# EAGLE schematic DUObot (EAGLE 7.3.0)
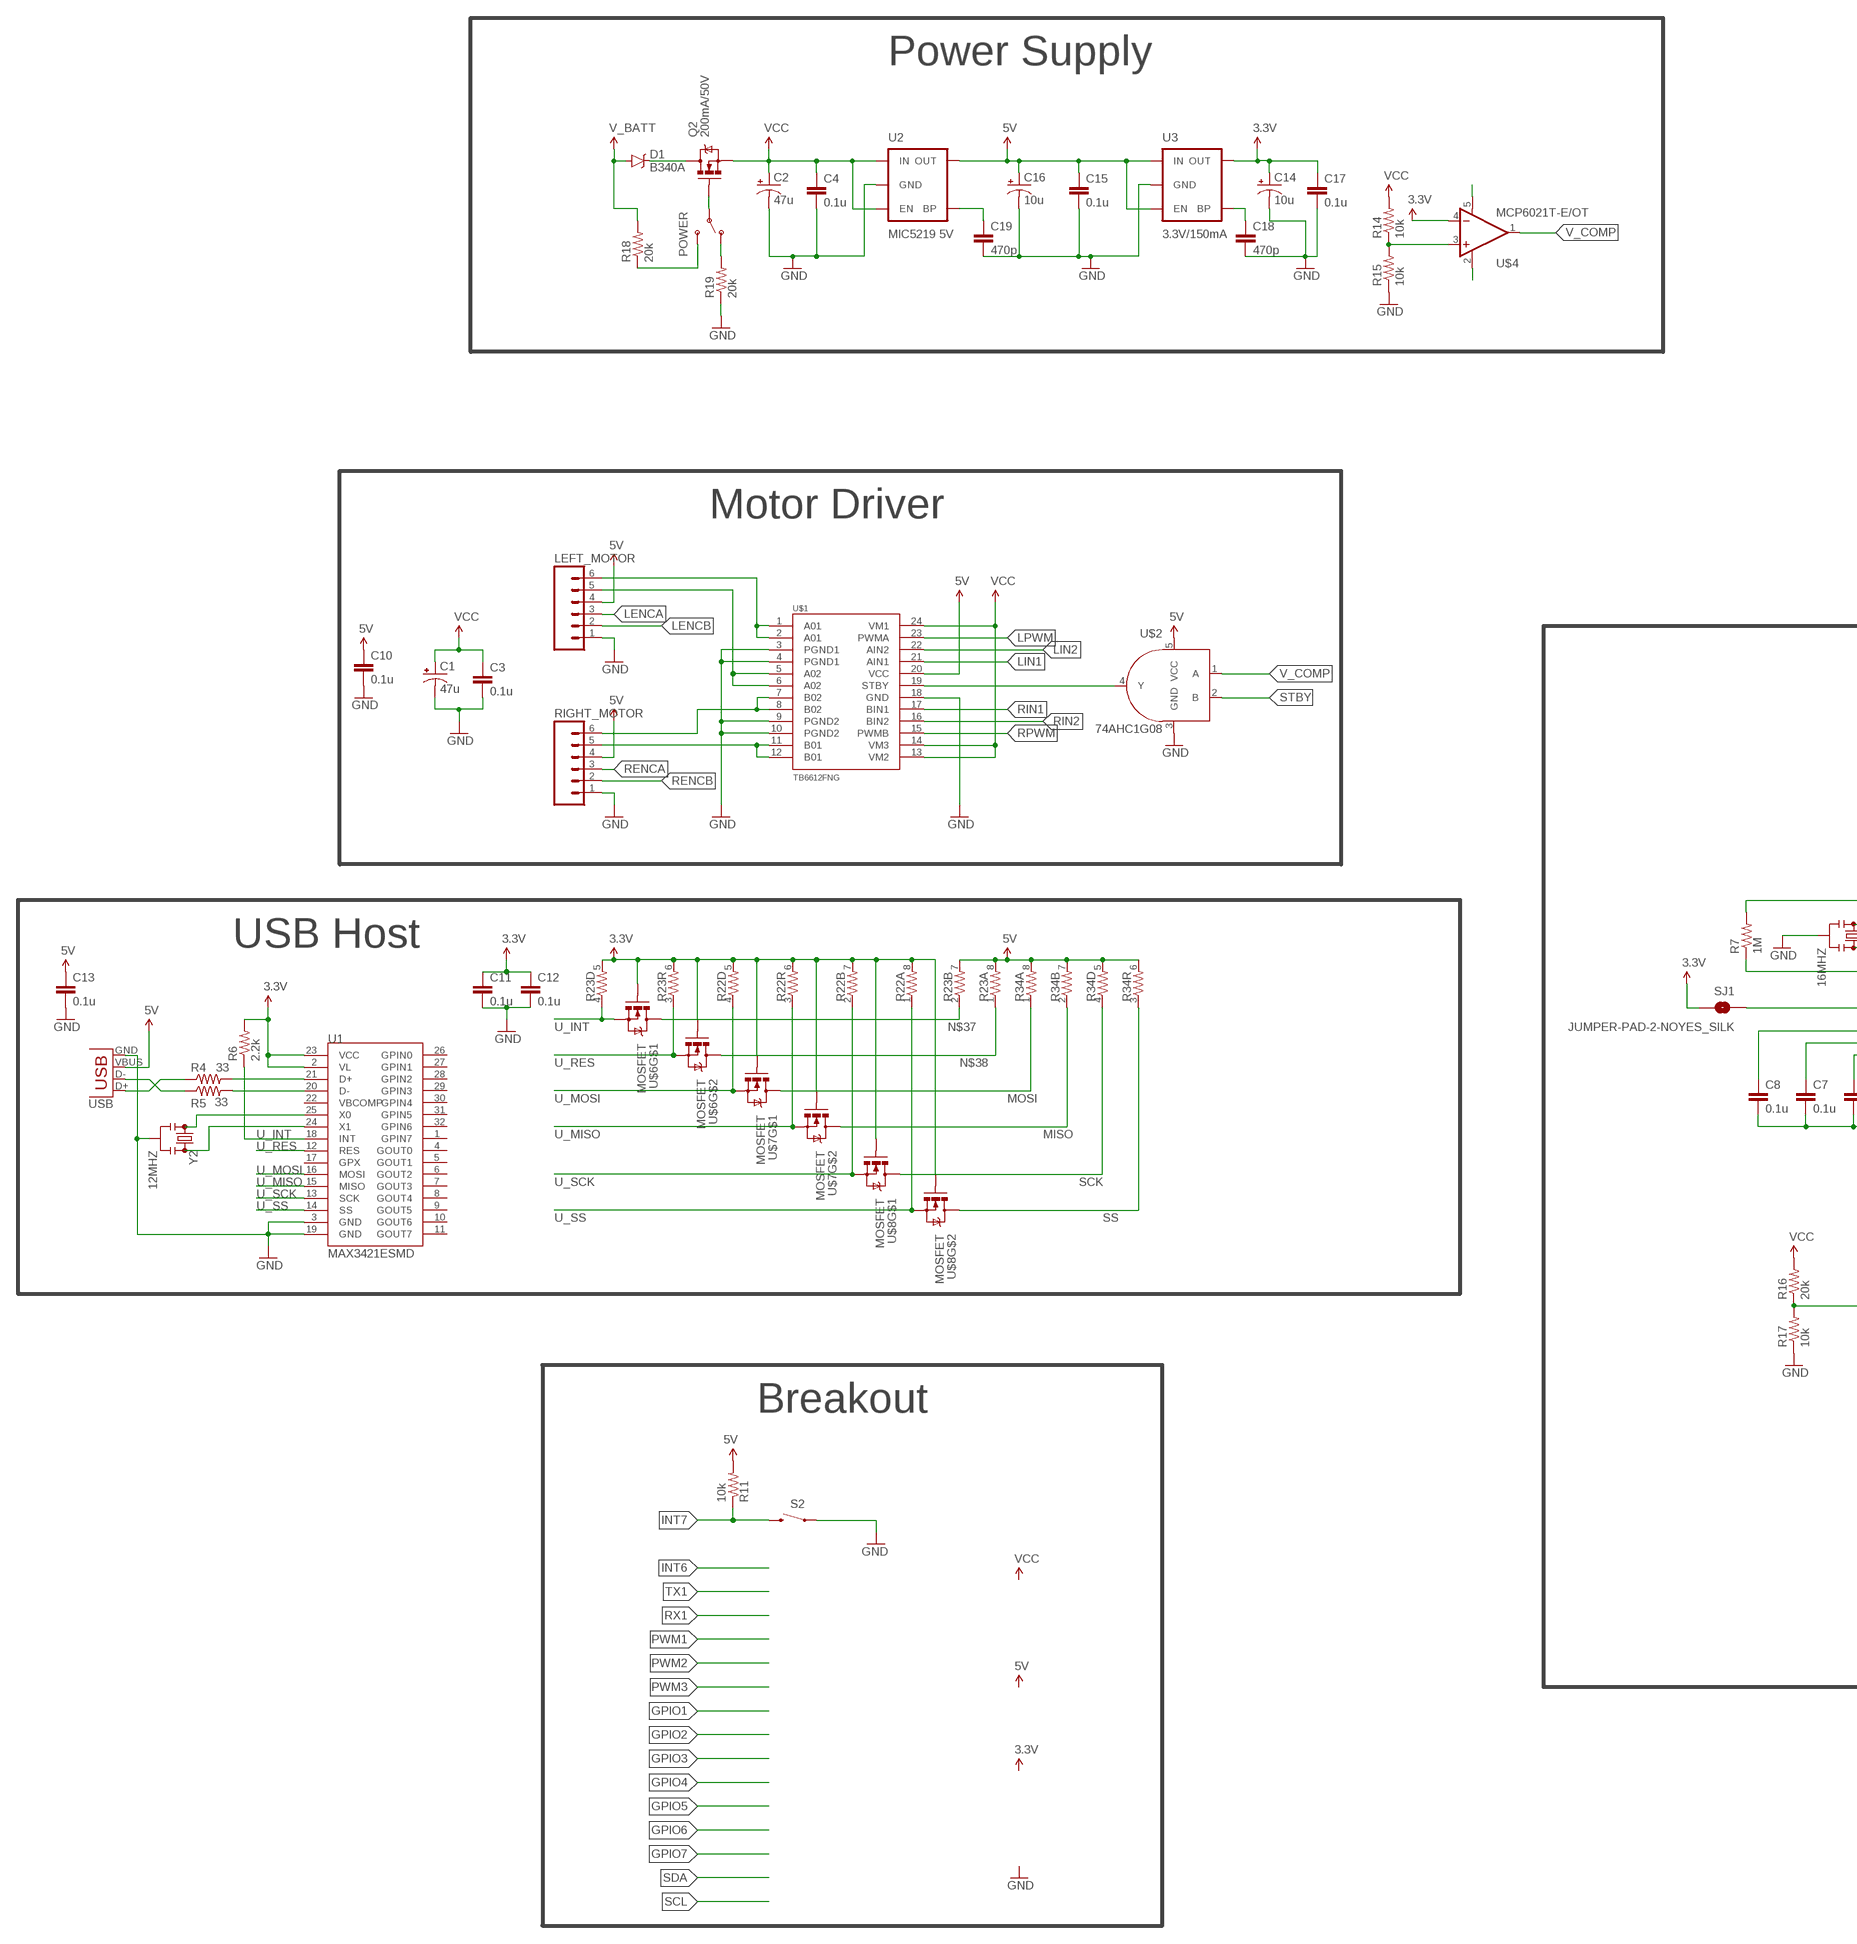
[diagram p0: schematic, sheet 1, part 1 of 2]
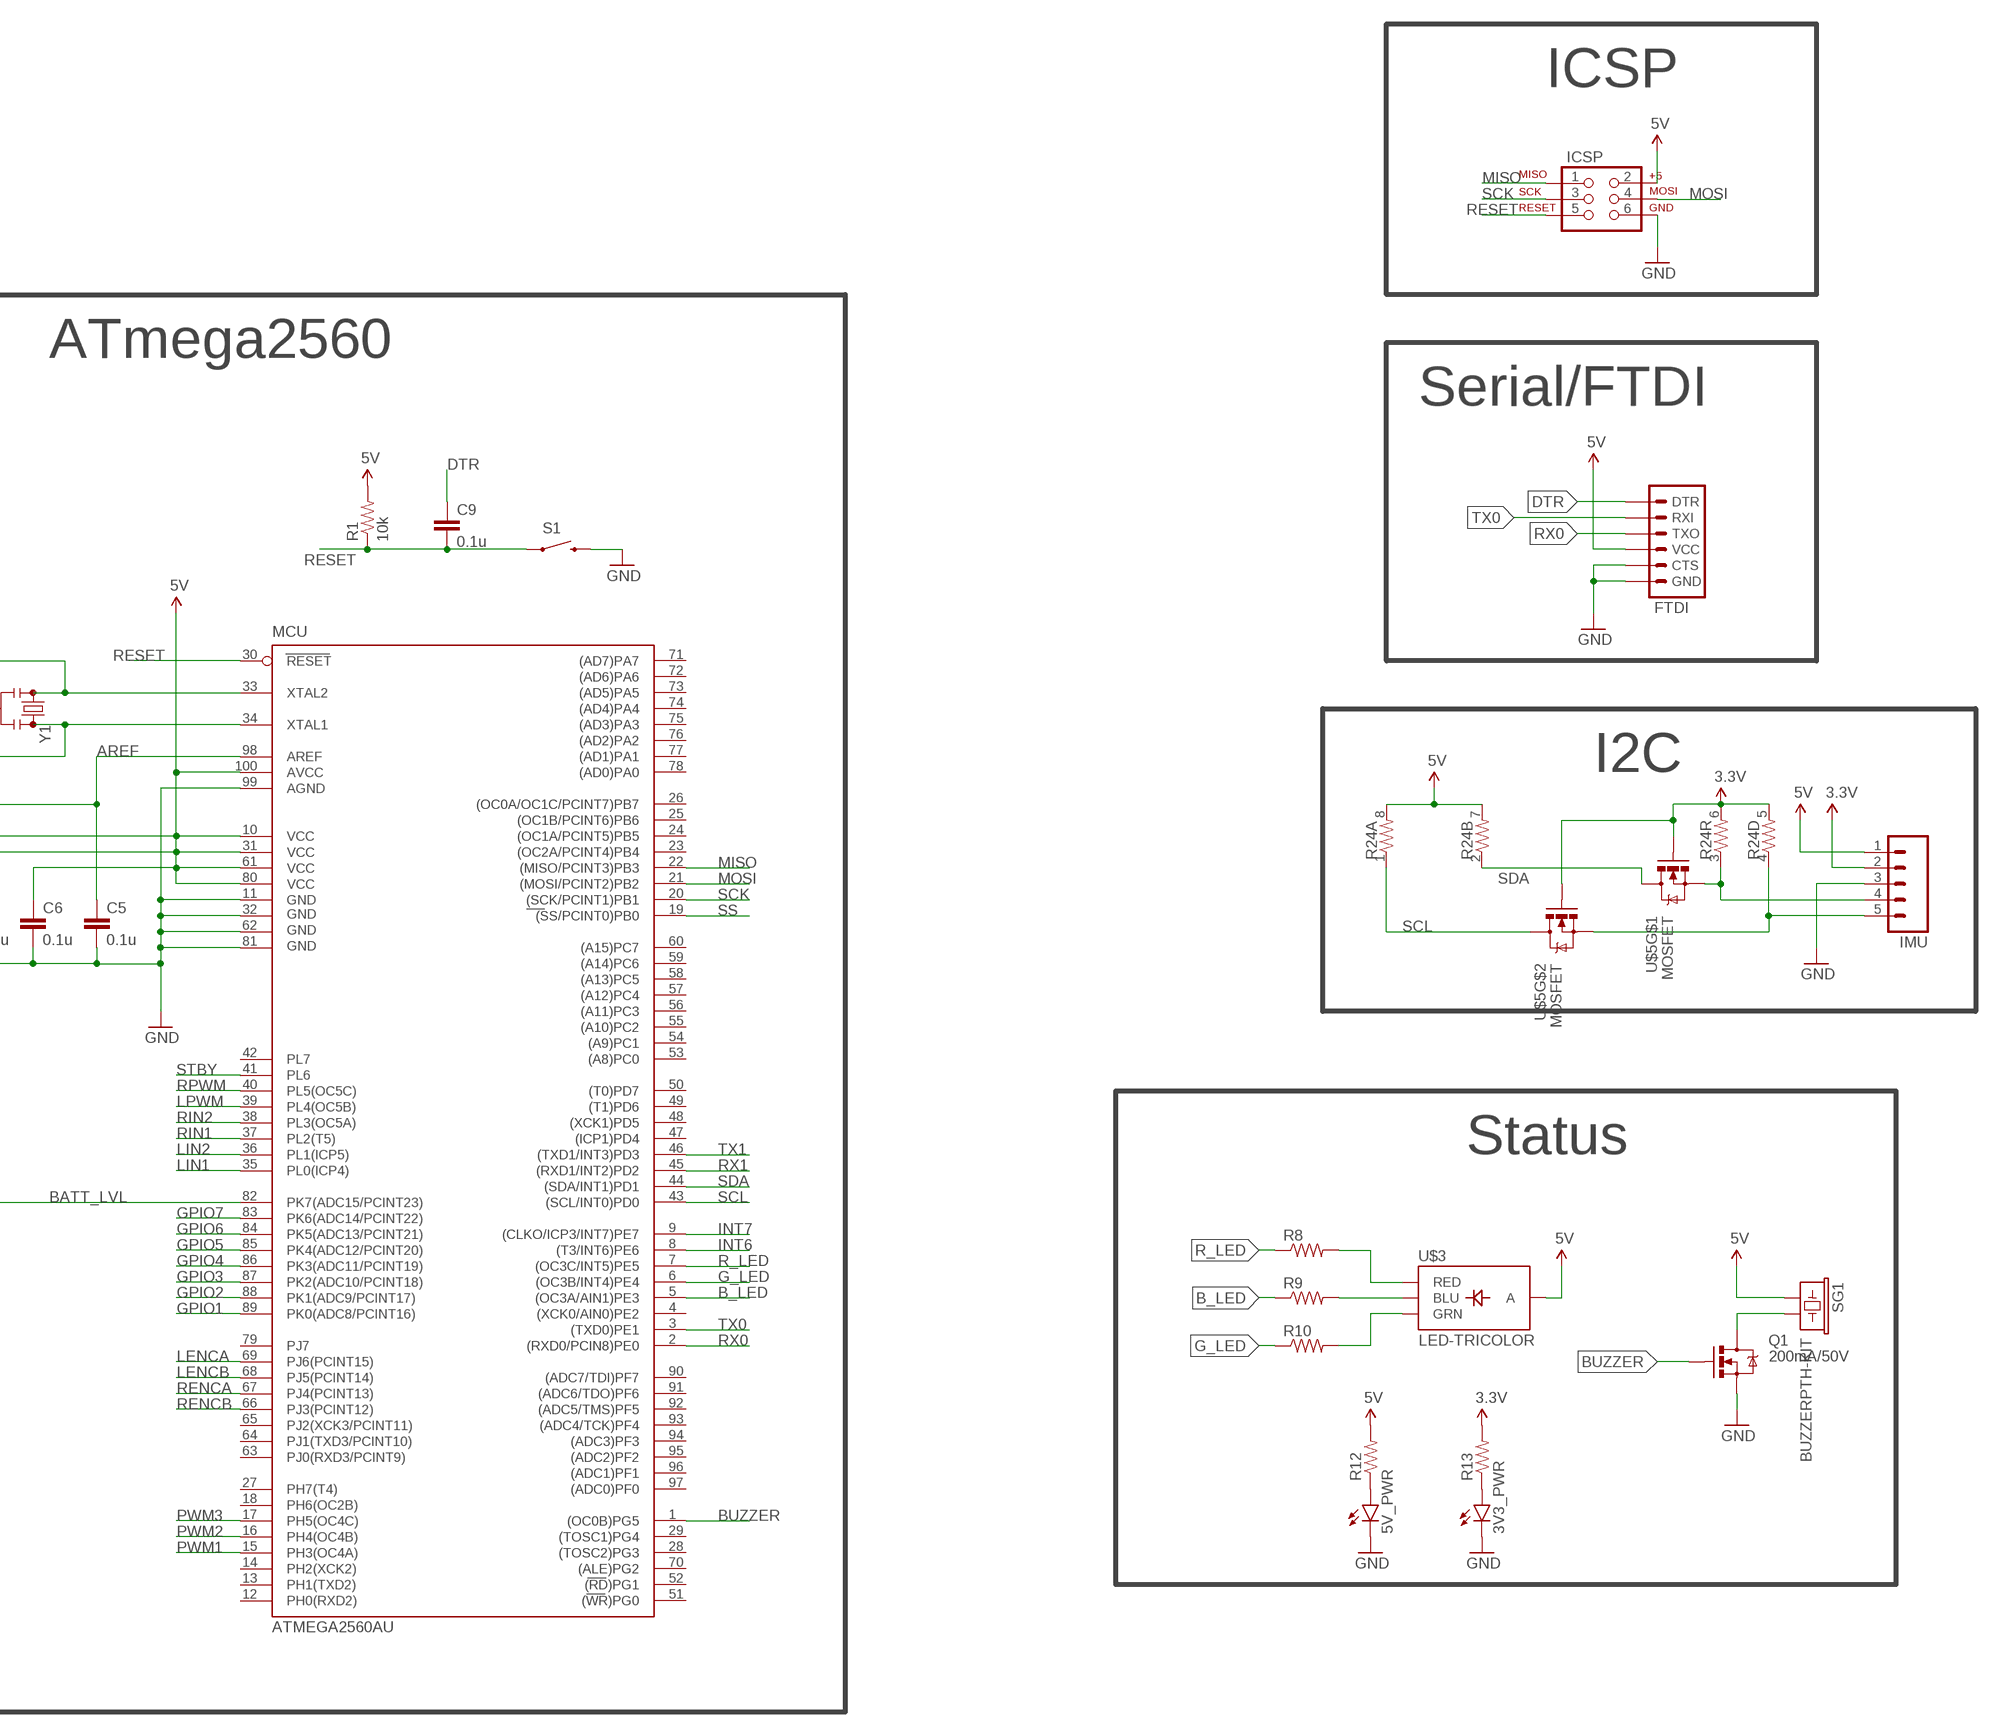
[diagram p1: schematic, sheet 1, part 2 of 2]

## Parts
3V3_PWR  LED0805  [LED-0805]
5V_PWR  LED0805  [LED-0805]
C1  47u  CAP_POLD  [PANASONIC_D]
C2  47u  CAP_POLD  [PANASONIC_D]
C3  0.1u  CAP0805  [0805]
C4  0.1u  CAP0805  [0805]
C5  0.1u  CAP0805  [0805]
C6  0.1u  CAP0805  [0805]
C7  0.1u  CAP0805  [0805]
C8  0.1u  CAP0805  [0805]
C9  0.1u  CAP0805  [0805]
C10  0.1u  CAP0805  [0805]
C11  0.1u  CAP0805  [0805]
C12  0.1u  CAP0805  [0805]
C13  0.1u  CAP0805  [0805]
C14  10u  CAP_POL1206  [EIA3216]
C15  0.1u  CAP0805  [0805]
C16  10u  CAP_POL1206  [EIA3216]
C17  0.1u  CAP0805  [0805]
C18  470p  CAP0805  [0805]
C19  470p  CAP0805  [0805]
D1  B340A  DIODE-SCHOTTKY-B340A  [SMA-DIODE]
FTDI  ARDUINO_SERIAL_PROGRAMPTH  [1X06]
ICSP  AVR_SPI_PRG_6TESTPOINTS  [2X3_TEST_POINTS]
IMU  M05SMD2  [1X05-1MM-RA]
LEFT_MOTOR  M06SMD-1MM  [1X06-1MM]
MCU  ATMEGA2560AU  [TQFP100]
POWER  SWITCH-SPDT-SMD-A  [SWITCH-SPST-SMD-A]
Q1  200mA/50V  MOSFET-NCHANNELBSS138  [SOT23-3]
Q2  200mA/50V  MOSFET-NCHANNELBSS138  [SOT23-3]
R1  10k  RESISTOR0805-RES  [0805]
R4  33  RESISTOR0805-RES  [0805]
R5  33  RESISTOR0805-RES  [0805]
R6  2.2k  RESISTOR0805-RES  [0805]
R7  1M  RESISTOR0805-RES  [0805]
R8  RESISTOR0805-RES  [0805]
R9  RESISTOR0805-RES  [0805]
R10  RESISTOR0805-RES  [0805]
R11  10k  RESISTOR0805-RES  [0805]
R12  RESISTOR0805-RES  [0805]
R13  RESISTOR0805-RES  [0805]
R14  10k  RESISTOR0805-RES  [0805]
R15  10k  RESISTOR0805-RES  [0805]
R16  20k  RESISTOR0805-RES  [0805]
R17  10k  RESISTOR0805-RES  [0805]
R18  20k  RESISTOR0805-RES  [0805]
R19  20k  RESISTOR0805-RES  [0805]
R22  RESISTOR-ARRAY0603-ARV  [0603-ARV]
R23  RESISTOR-ARRAY0603-ARV  [0603-ARV]
R24  RESISTOR-ARRAY0603-ARV  [0603-ARV]
R34  RESISTOR-ARRAY0603-ARV  [0603-ARV]
RIGHT_MOTOR  M06SMD-1MM  [1X06-1MM]
S1  SWITCH-MOMENTARY-2SMD-4  [TACTILE_SWITCH_TALL]
S2  SWITCH-MOMENTARY-2SMD-4  [TACTILE_SWITCH_TALL]
SG1  BUZZERPTH-KIT  [BUZZER-12MM-KIT]
SJ1  JUMPER-PAD-2-NOYES_SILK  [PAD-JUMPER-2-NO_YES_SILK]
U1  MAX3421ESMD  [TQFP32-5MM]
U2  MIC5219 5V  V_REG_MIC52195V  [SOT23-5]
U3  3.3V/150mA  V_REG_MIC52053.3V  [SOT23-5]
U$1  TB6612FNG  [SSOP24]
U$2  74AHC1G08  [SOT353]
U$3  LED-TRICOLOR  [LED-TRICOLOR-SMD]
U$4  MCP6021T-E/OT  [SOT23-5]
U$5  MOSFET  [SOT363_V2]
U$6  MOSFET  [SOT363_V2]
U$7  MOSFET  [SOT363_V2]
U$8  MOSFET  [SOT363_V2]
USB  USB-A-SMD  [USB-A-S-NOSILK-FEMALE]
Y1  16MHZ  RESONATOR16MHZ  [RESONATOR-SMD]
Y2  12MHZ  RESONATOR16MHZ  [RESONATOR-SMD]

## Nets
3.3V: C11.1 C12.1 C14.A(+) C17.1 IMU.2 R6.2 R13.2 R22.5 R22.6 R22.7 R22.8 R23.5 R23.6 R24.5 R24.6 SJ1.2 U1.2(VL) U1.23(VCC) U3.5(OUT) U$4.4(-IN) U$5.G1(G) U$5.G2(G) U$6.G1(G) U$6.G2(G) U$7.G1(G) U$7.G2(G) U$8.G1(G) U$8.G2(G)
5V: C6.1 C7.1 C8.1 C10.1 C13.1 C15.1 C16.A(+) FTDI.4(VCC) ICSP.2 IMU.1 LEFT_MOTOR.4 MCU.10(VCC) MCU.31(VCC1) MCU.61(VCC2) MCU.80(VCC3) MCU.100(AVCC) R1.2 R11.2 R12.2 R23.7 R23.8 R24.7 R24.8 R34.5 R34.6 R34.7 R34.8 RIGHT_MOTOR.4 SG1.+ U2.5(OUT) U3.1(IN) U3.3(EN) U$1.20(VCC) U$2.5(VCC) U$3.A USB.VBUS
AREF: C5.1 MCU.98(AREF) SJ1.1
B_LED: MCU.5((OC3A/AIN1)PE3) R9.1
BATT_LVL: MCU.82(PK7(ADC15/PCINT23)) R16.1 R17.2
BUZZER: MCU.1((OC0B)PG5) Q1.1(G)
DTR: C9.1 FTDI.1(DTR)
G_LED: MCU.6((OC3B/INT4)PE4) R10.1
GND: 3V3_PWR.CATHODE(C) 5V_PWR.CATHODE(C) C1.- C2.- C3.2 C4.2 C5.2 C6.2 C7.2 C8.2 C10.2 C11.2 C12.2 C13.2 C14.C(-) C15.2 C16.C(-) C17.2 C18.2 C19.2 FTDI.5(CTS) FTDI.6(GND) ICSP.6 IMU.3 LEFT_MOTOR.1 MCU.11(GND) MCU.32(GND1) MCU.62(GND2) MCU.81(GND3) MCU.99(AGND) Q1.2(S) R15.1 R17.1 R19.1 RIGHT_MOTOR.1 S1.B2 S2.A2 U1.3(GND) U1.19(GND) U2.2(GND) U3.2(GND) U$1.3(PGND1) U$1.4(PGND1) U$1.9(PGND2) U$1.10(PGND2) U$1.18(GND) U$2.3(GND) USB.GND Y1.2 Y2.2
GPIO1: MCU.89(PK0(ADC8/PCINT16))
GPIO2: MCU.88(PK1(ADC9/PCINT17))
GPIO3: MCU.87(PK2(ADC10/PCINT18))
GPIO4: MCU.86(PK3(ADC11/PCINT19))
GPIO5: MCU.85(PK4(ADC12/PCINT20))
GPIO6: MCU.84(PK5(ADC13/PCINT21))
GPIO7: MCU.83(PK6(ADC14/PCINT22))
INT6: MCU.8((T3/INT6)PE6)
INT7: MCU.9((CLKO/ICP3/INT7)PE7) R11.1 S2.B2
LENCA: LEFT_MOTOR.3 MCU.69(PJ6(PCINT15))
LENCB: LEFT_MOTOR.2 MCU.68(PJ5(PCINT14))
LIN1: MCU.35(PL0(ICP4)) U$1.21(AIN1)
LIN2: MCU.36(PL1(ICP5)) U$1.22(AIN2)
LPWM: MCU.39(PL4(OC5B)) U$1.23(PWMA)
MISO: ICSP.1 MCU.22((MISO/PCINT3)PB3) R34.2 U$7.D2(D)
MOSI: ICSP.4 MCU.21((MOSI/PCINT2)PB2) R34.1 U$7.D1(D)
N$1: RIGHT_MOTOR.5 U$1.11(B01) U$1.12(B01)
N$2: RIGHT_MOTOR.6 U$1.7(B02) U$1.8(B02)
N$3: LEFT_MOTOR.6 U$1.1(A01) U$1.2(A01)
N$4: LEFT_MOTOR.5 U$1.5(A02) U$1.6(A02)
N$5: MCU.33(XTAL2) R7.2 Y1.1
N$6: MCU.34(XTAL1) R7.1 Y1.3
N$7: R4.1 USB.D+
N$8: R5.2 U1.20(D-)
N$9: R4.2 U1.21(D+)
N$10: R5.1 USB.D-
N$11: R14.1 R15.2 U$4.3(+IN)
N$12: U$1.19(STBY) U$2.4(Y)
N$13: Q1.3(D) SG1.-
N$14: R9.2 U$3.B(BLU)
N$15: R8.2 U$3.R(RED)
N$16: R10.2 U$3.G(GRN)
N$17: 5V_PWR.ANODE(A) R12.1
N$18: 3V3_PWR.ANODE(A) R13.1
N$19: U1.25(X0) Y2.1
N$20: U1.24(X1) Y2.3
N$21: C19.1 U2.4(BP)
N$22: C18.1 U3.4(BP)
N$23: U$4.2(V-)
N$24: U$4.5(V+)
N$25: D1.C Q2.3(D)
N$27: POWER.1(O) R19.2
N$28: POWER.3(S) R18.1
N$29: POWER.2(P) Q2.1(G)
N$32: IMU.4 R24.3 U$5.S1(S)
N$33: IMU.5 R24.4 U$5.S2(S)
N$37: R23.2 U$6.D1(D)
N$38: R23.1 U$6.D2(D)
PWM1: MCU.15(PH3(OC4A))
PWM2: MCU.16(PH4(OC4B))
PWM3: MCU.17(PH5(OC4C))
R_LED: MCU.7((OC3C/INT5)PE5) R8.1
RENCA: MCU.67(PJ4(PCINT13)) RIGHT_MOTOR.3
RENCB: MCU.66(PJ3(PCINT12)) RIGHT_MOTOR.2
RESET: C9.2 ICSP.5 MCU.30(RESET) R1.1 S1.A2
RIN1: MCU.37(PL2(T5)) U$1.17(BIN1)
RIN2: MCU.38(PL3(OC5A)) U$1.16(BIN2)
RPWM: MCU.40(PL5(OC5C)) U$1.15(PWMB)
RX0: FTDI.3(TXO) MCU.2((RXD0/PCIN8)PE0)
RX1: MCU.45((RXD1/INT2)PD2)
SCK: ICSP.3 MCU.20((SCK/PCINT1)PB1) R34.4 U$8.D1(D)
SCL: MCU.43((SCL/INT0)PD0) R24.1 U$5.D2(D)
SDA: MCU.44((SDA/INT1)PD1) R24.2 U$5.D1(D)
SS: MCU.19((SS/PCINT0)PB0) R34.3 U$8.D2(D)
STBY: MCU.41(PL6) U$2.2(B)
TX0: FTDI.2(RXI) MCU.3((TXD0)PE1)
TX1: MCU.46((TXD1/INT3)PD3)
U_INT: R6.1 R23.4 U1.18(INT) U$6.S1(S)
U_MISO: R22.3 U1.15(MISO) U$7.S2(S)
U_MOSI: R22.4 U1.16(MOSI) U$7.S1(S)
U_RES: R23.3 U1.12(RES) U$6.S2(S)
U_SCK: R22.2 U1.13(SCK) U$8.S1(S)
U_SS: R22.1 U1.14(SS) U$8.S2(S)
V_BATT: D1.A R18.2
V_COMP: U$2.1(A) U$4.1(OUT)
VCC: C1.+ C2.+ C3.1 C4.1 Q2.2(S) R14.2 R16.2 U2.1(IN) U2.3(EN) U$1.13(VM2) U$1.14(VM3) U$1.24(VM1)
Unconnected: MCU.4((XCK0/AIN0)PE2) MCU.12(PH0(RXD2)) MCU.13(PH1(TXD2)) MCU.14(PH2(XCK2)) MCU.18(PH6(OC2B)) MCU.23((OC2A/PCINT4)PB4) MCU.24((OC1A/PCINT5)PB5) MCU.25((OC1B/PCINT6)PB6) MCU.26((OC0A/OC1C/PCINT7)PB7) MCU.27(PH7(T4)) MCU.28((TOSC2)PG3) MCU.29((TOSC1)PG4) MCU.42(PL7) MCU.47((ICP1)PD4) MCU.48((XCK1)PD5) MCU.49((T1)PD6) MCU.50((T0)PD7) MCU.51((WR)PG0) MCU.52((RD)PG1) MCU.53((A8)PC0) MCU.54((A9)PC1) MCU.55((A10)PC2) MCU.56((A11)PC3) MCU.57((A12)PC4) MCU.58((A13)PC5) MCU.59((A14)PC6) MCU.60((A15)PC7) MCU.63(PJ0(RXD3/PCINT9)) MCU.64(PJ1(TXD3/PCINT10)) MCU.65(PJ2(XCK3/PCINT11)) MCU.70((ALE)PG2) MCU.71((AD7)PA7) MCU.72((AD6)PA6) MCU.73((AD5)PA5) MCU.74((AD4)PA4) MCU.75((AD3)PA3) MCU.76((AD2)PA2) MCU.77((AD1)PA1) MCU.78((AD0)PA0) MCU.79(PJ7) MCU.90((ADC7/TDI)PF7) MCU.91((ADC6/TDO)PF6) MCU.92((ADC5/TMS)PF5) MCU.93((ADC4/TCK)PF4) MCU.94((ADC3)PF3) MCU.95((ADC2)PF2) MCU.96((ADC1)PF1) MCU.97((ADC0)PF0) U1.1(GPIN7) U1.4(GOUT0) U1.5(GOUT1) U1.6(GOUT2) U1.7(GOUT3) U1.8(GOUT4) U1.9(GOUT5) U1.10(GOUT6) U1.11(GOUT7) U1.17(GPX) U1.22(VBCOMP) U1.26(GPIN0) U1.27(GPIN1) U1.28(GPIN2) U1.29(GPIN3) U1.30(GPIN4) U1.31(GPIN5) U1.32(GPIN6)

## Notes on the sheet
- Power Supply
- ICSP
- Motor Driver
- ATmega2560
- Serial/FTDI
- USB Host
- I2C
- Status
- Breakout

## Library data of the parts
3V3_PWR 5V_PWR = SparkFun-LED:LED: LEDs Standard schematic elements and footprints for 5mm, 3mm, 1206, and 0603 sized LEDs. 5mm - Spark Fun Electronics SKU : COM-00529 (and others)
C1 C2 = SparkFun-Capacitors:CAP_POL: Capacitor Polarized These are standard SMD and PTH capacitors. Normally 10uF, 47uF, and 100uF in electrolytic and tantalum varieties. Always verify the external diameter of the through hole cap, it varies with capacity, voltage, and manufacturer. The EIA devices should be standard.
C3-C13 C15 C17-C19 = SparkFun-Passives:CAP: Capacitor Standard 0603 ceramic capacitor, and 0.1" leaded capacitor.
C14 C16 = SparkFun-Passives:CAP_POL: Capacitor Polarized These are standard SMD and PTH capacitors. Normally 10uF, 47uF, and 100uF in electrolytic and tantalum varieties. Always verify the external diameter of the through hole cap, it varies with capacity, voltage, and manufacturer. The EIA devices should be standard.
D1 = SparkFun-DiscreteSemi:DIODE-SCHOTTKY: Schottky diodes in SFE's production catalog BAT20J 1A 23V 0.62Vf RB751 120mA 40V 0.37Vf PMEG4005EJ 0.5A 40V 0.42Vf MBRA140 1A 40V 0.5Vf B340A 3A 40V SMA; PROD_ID: DIO-09886
FTDI = SparkFun-Connectors:ARDUINO_SERIAL_PROGRAM: FTDI connector footprints
ICSP = SparkFun-Connectors:AVR_SPI_PRG_6: AVR ISP 6 Pin This is the reduced ISP connector for AVR programming. Common on Arduino. This footprint will take up less PCB space and can be used with a 10-pin to 6-pin adapter such as SKU: BOB-08508 **Special note about "TEST_POINT" package. The stop mask is on the top side, so if you want your programming test points to be on the bottom of your board, make sure to place this package on the bottom side of the board. This also ensure that the orientation to program from the bottom side will be correct.
IMU = SparkFun-Connectors:M05: Header 5 Standard 5-pin 0.1" header. Use with straight break away headers (SKU : PRT-00116), right angle break away headers (PRT-00553), swiss pins (PRT-00743), machine pins (PRT-00117), and female headers (PRT-00115). Molex polarized connector foot print use with SKU : PRT-08230 with associated crimp pins and housings.
LEFT_MOTOR RIGHT_MOTOR = SparkFun-Connectors:M06: Header 6 Standard 6-pin 0.1" header. Use with straight break away headers (SKU : PRT-00116), right angle break away headers (PRT-00553), swiss pins (PRT-00743), machine pins (PRT-00117), and female headers (PRT-00115). Molex polarized connector foot print use with SKU : PRT-08094 with associated crimp pins and housings. NOTES ON THE VARIANTS LOCK and LOCK_LONGPADS... This footprint was designed to help hold the alignment of a through-hole component (i.e. 6-pin header) while soldering it into place. You may notice that each hole has been shifted either up or down by 0.005 of an inch from it's more standard position (which is a perfectly straight line). This slight alteration caused the pins (the squares in the middle) to touch the edges of the holes. Because they are alternating, it causes a "brace" to hold the component in place. 0.005 has proven to be the perfect amount of "off-center" position when using our standard breakaway headers. Although looks a little odd when you look at the bare footprint, once you have a header in there, the alteration is very hard to notice. Also,if you push a header all the way into place, it is covered up entirely on the bottom side. This idea of altering the position of holes to aid alignment will be further integrated into the Sparkfun Library for other footprints. It can help hold any component with 3 or more connection pins.
MCU = SparkFun-DigitalIC:ATMEGA2560: Atmel 100-pin 8-bit uC 64/128/256 Kbytes FLASH 4 Kbytes EEPROM 8 Kbytes SRAM 86 General Purpose I/O pins 12-channels16-bit PWM 4 x Serial USARTs 16-channels 10-bit A/D
POWER = SparkFun-Electromechanical:SWITCH-SPDT: SPDT Switch Simple slide switch, Spark Fun Electronics SKU : COM-00102 DPDT SMT slide switch, AYZ0202, SWCH-08179
Q1 Q2 = SparkFun-DiscreteSemi:MOSFET-NCHANNEL: Common NMOSFET Parts MFG P/N Store ID Prod ID FDD8780 TRANS-09984 SI7820DN TRANS-11055 FDS6630A IC-08089 2N7002PW TRANS-11151 FQP30N06L COM-10213 TRANS-10060 BSS123LT1G TRANS-08345 BSS138 TRANS-00830 BS170 2N7000; PROD_ID: TRANS-00830
R1 R4-R19 = SparkFun-Passives:RESISTOR: Resistor Basic schematic elements and footprints for 0603, 1206, and PTH resistors.
R22-R24 R34 = SparkFun-Resistors:RESISTOR-ARRAY: Array Chip Resistor Source: RS Component / Phycomp
S1 S2 = SparkFun-Electromechanical:SWITCH-MOMENTARY-2: Various NO switches- pushbuttons, reed, etc; PROD_ID: SWCH-11966
SG1 = SparkFun-Electromechanical:BUZZER: Buzzer 12mm Spark Fun Electronics SKU : Comp-Buzzer; PROD_ID: COMP-08253
SJ1 = SparkFun-Passives:JUMPER-PAD-2-NO
U1 = SparkFun-DigitalIC:MAX3421E: USB Peripheral/Host Controller w/ SPI
U2 = SparkFun-PowerIC:V_REG_MIC5219: V_REG MIC5219 Standard 3.3V and 5V 500mA LDO voltage regulator in SOT-23 layout. Micrel part MIC5219. BP (by-pass) pin is used to lower output noise with 470pF cap, may be left open.; PROD_ID: VREG-10107
U3 = SparkFun-PowerIC:V_REG_MIC5205: V_REG MIC5205 Standard 3.3V, 5V, and Adjustable 150mA LDO voltage regulator in SOT-23 layout. Micrel part MIC5205. BP (by-pass) pin is used to lower output noise with 470pF cap, may be left open. On the adjustable version BP is used to set output.; PROD_ID: VREG-00822
U$1 = SparkFun-PowerIC:TB6612FNG: Toshiba 1A dual motor driver IC-09363; PROD_ID: IC-09363
U$2 = SparkFun-DigitalIC:74AHC1G08: Single 2-input AND gate; PROD_ID: IC-10841
U$3 = SparkFun-LED:LED-TRICOLOR: Tri-Color LED SMD Proven layout and schematic for triple color LED in SMD package - common anode. Spark Fun Electronics SKU : COM-07844
U$4 = SparkFun-AnalogIC:MCP6021: Rail-to-rail input/output op-amp with 10 MHz bandwidth.; PROD_ID: IC-12504
U$5-U$8 = SparkFun-DiscreteSemi:MOSFET
USB = SparkFun-Connectors:USB: USB Connectors USB-B-PTH is fully proven SKU : PRT-00139/CONN-08278 USB-miniB is fully proven SKU : PRT-00587 USB-A-PCB is untested. USB-A-H is throughly reviewed, but untested. Spark Fun Electronics SKU : PRT-00437 USB-B-SMT is throughly reviewed, but untested. Needs silkscreen touching up. USB-A-S has not been used/tested USB-MB-H has not been used/tested USB-MICROB has been used. CONN-09505; PROD_ID: CONN-09520
Y1 = SparkFun-FreqCtrl:RESONATOR: Resonator Small SMD resonator. Used, eg, on the Arduino Pro/ Pro Mini boards. 8MHz- XTAL-08895 16MHz- XTAL-08900; PROD_ID: XTAL-08900
Y2 = SparkFun-FreqCtrl:RESONATOR: Resonator Small SMD resonator. Used, eg, on the Arduino Pro/ Pro Mini boards. 8MHz- XTAL-08895 16MHz- XTAL-08900; PROD_ID: XTAL-08900; VALUE: 16MHZ